# Altium schematic sheet [05] - PROGRAMMER.SchDoc
size A4
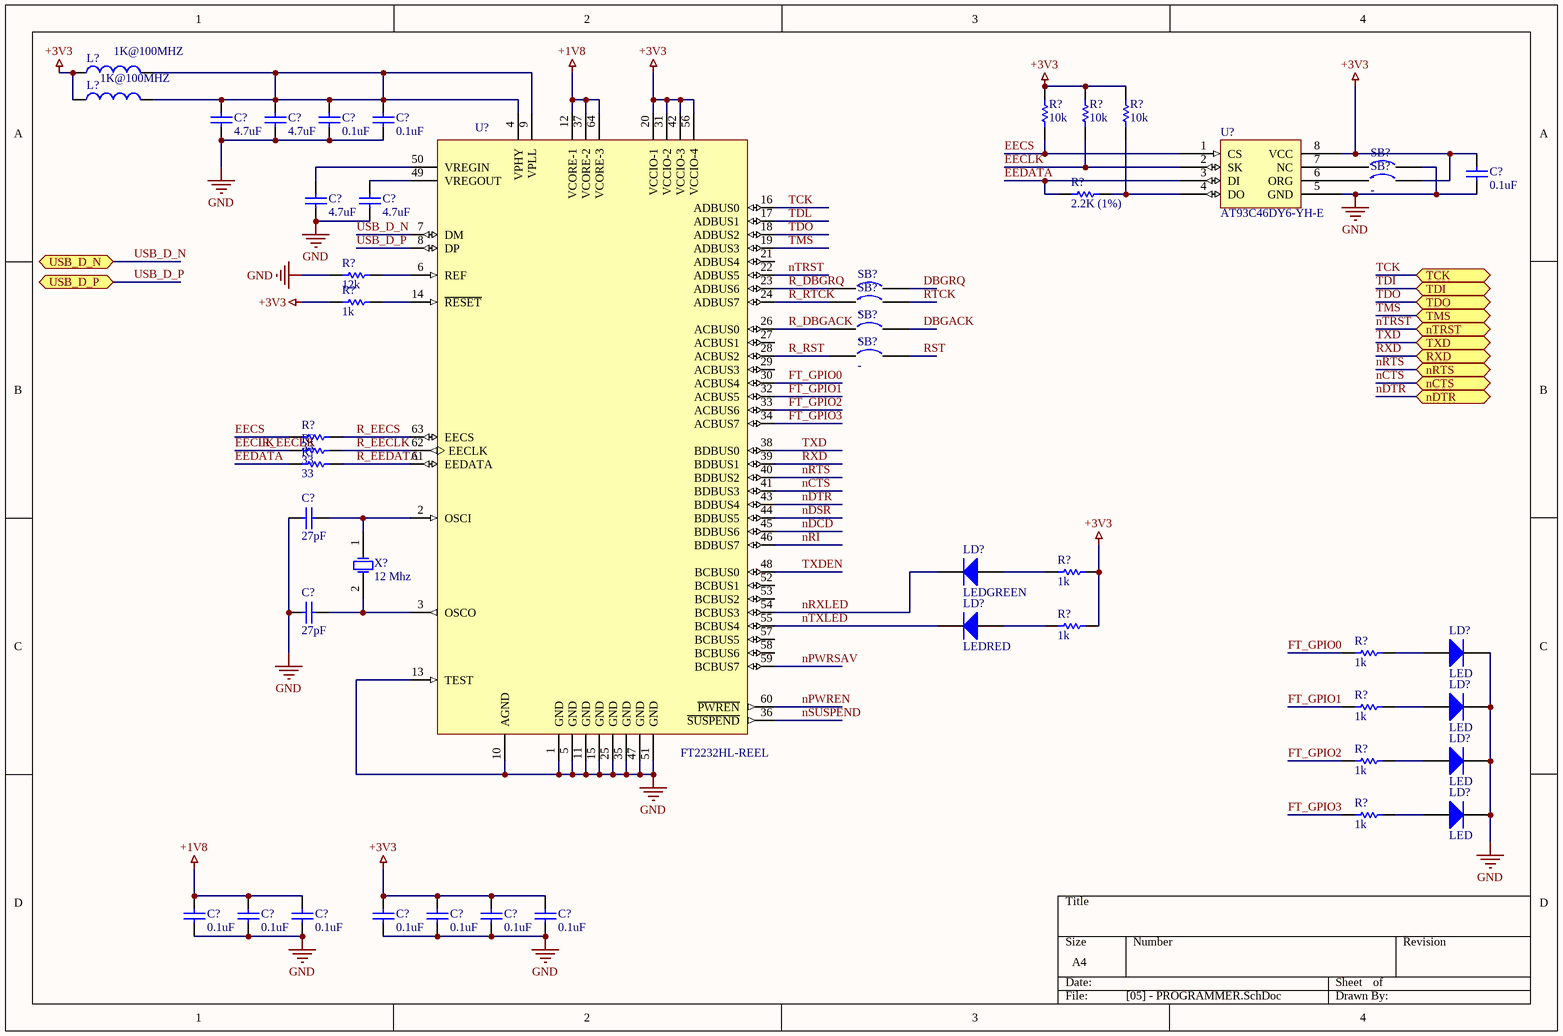
[diagram p0: [05] - PROGRAMMER.SchDoc]

## Parts
(Parts that share a designator on the sheet are numbered #1, #2 ... from top to bottom, then left to right.)
C?#1  0.1uF
C?#2  0.1uF
C?#3  4.7uF
C?#4  4.7uF
C?#5  0.1uF
C?#6  4.7uF
C?#7  4.7uF
C?#8  27pF
C?#9  27pF
C?#10  0.1uF
C?#11  0.1uF
C?#12  0.1uF
C?#13  0.1uF
C?#14  0.1uF
C?#15  0.1uF
C?#16  0.1uF
L?#1  1K@100MHZ
L?#2  1K@100MHZ
LD?#1  LEDGREEN
LD?#2  LEDRED
LD?#3  LED
LD?#4  LED
LD?#5  LED
LD?#6  LED
R?#1  10k
R?#2  10k
R?#3  10k
R?#4  2.2K (1%)
R?#5  12k
R?#6  1k
R?#7  33
R?#8  33
R?#9  33
R?#10  1k
R?#11  1k
R?#12  1k
R?#13  1k
R?#14  1k
R?#15  1k
SB?#1  -  [Solder Bridge]
SB?#2  -  [Solder Bridge]
SB?#3  -  [Solder Bridge]
SB?#4  -  [Solder Bridge]
SB?#5  -  [Solder Bridge]
SB?#6  -  [Solder Bridge]
U?#1  AT93C46DY6-YH-E
U?#2  FT2232HL-REEL  [*QFP50P1200X1200X160-64N]
X?  12 Mhz  [ABLS2-12.000MHZ-D4Y-T]

## Ports
nCTS (bidir), nDTR (bidir), nRTS (bidir), nTRST (bidir), RXD (bidir), TCK (bidir), TDI (bidir), TDO (bidir), TMS (bidir), TXD (bidir), USB_D_N (bidir), USB_D_P (bidir)

## Nets
+1V8: C?#10.2 C?#11.2 C?#12.2 U?#2.12(VCORE-1) U?#2.37(VCORE-2) U?#2.64(VCORE-3)
+3V3: C?#5.2 C?#13.2 C?#14.2 C?#15.2 C?#16.2 L?#1.1 L?#2.1 R?#1.2 R?#2.2 R?#3.2 R?#6.1 R?#10.2 R?#11.2 SB?#2.2 U?#1.8(VCC) U?#2.20(VCCIO-1) U?#2.31(VCCIO-2) U?#2.42(VCCIO-3) U?#2.56(VCCIO-4)
GND: C?#1.1 C?#2.1 C?#3.1 C?#4.1 C?#5.1 C?#6.2 C?#7.1 C?#8.2 C?#9.2 C?#10.1 C?#11.1 C?#12.1 C?#13.1 C?#14.1 C?#15.1 C?#16.1 LD?#3.2(K) LD?#4.2(K) LD?#5.2(K) LD?#6.2(K) R?#5.1 SB?#1.2 U?#1.5(GND) U?#2.1(GND) U?#2.5(GND) U?#2.10(AGND) U?#2.11(GND) U?#2.13(TEST) U?#2.15(GND) U?#2.25(GND) U?#2.35(GND) U?#2.47(GND) U?#2.51(GND)
DBGACK: SB?#5.2
DBGRQ: SB?#3.2
EECLK: R?#2.1 R?#8.1 R?#8.2 U?#1.2(SK) U?#2.62(EECLK)  [also labelled R_EECLK]
EECS: R?#1.1 R?#7.1 U?#1.1(CS)
EEDATA: R?#4.1 R?#9.1 U?#1.3(DI)
FT_GPIO0: R?#12.1 U?#2.30(ACBUS4)
FT_GPIO1: R?#13.1 U?#2.32(ACBUS5)
FT_GPIO2: R?#14.1 U?#2.33(ACBUS6)
FT_GPIO3: R?#15.1 U?#2.34(ACBUS7)
nCTS: U?#2.41(BDBUS3) ; port nCTS
nDCD: U?#2.45(BDBUS6)
nDSR: U?#2.44(BDBUS5)
nDTR: U?#2.43(BDBUS4) ; port nDTR
nPWREN: U?#2.60(~{PWREN})
nPWRSAV: U?#2.59(BCBUS7)
nRI: U?#2.46(BDBUS7)
nRTS: U?#2.40(BDBUS2) ; port nRTS
nRXLED: LD?#1.2(K) U?#2.54(BCBUS3)
nSUSPEND: U?#2.36(~{SUSPEND})
nTRST: U?#2.22(ADBUS5) ; port nTRST
nTXLED: LD?#2.2(K) U?#2.55(BCBUS4)
R_DBGACK: SB?#5.1 U?#2.26(ACBUS0)
R_DBGRQ: SB?#3.1 U?#2.23(ADBUS6)
R_EECS: R?#7.2 U?#2.63(EECS)
R_EEDATA: R?#9.2 U?#2.61(EEDATA)
R_RST: SB?#6.1 U?#2.28(ACBUS2)
R_RTCK: SB?#4.1 U?#2.24(ADBUS7)
RST: SB?#6.2
RTCK: SB?#4.2
RXD: U?#2.39(BDBUS1) ; port RXD
TCK: U?#2.16(ADBUS0) ; port TCK
TDI: port TDI
TDL: U?#2.17(ADBUS1)
TDO: U?#2.18(ADBUS2) ; port TDO
TMS: U?#2.19(ADBUS3) ; port TMS
TXD: U?#2.38(BDBUS0) ; port TXD
TXDEN: U?#2.48(BCBUS0)
USB_D_N: U?#2.7(DM) ; port USB_D_N
USB_D_P: U?#2.8(DP) ; port USB_D_P
NetC?#1_2: C?#1.2 C?#2.2 C?#3.2 C?#4.2 L?#1.2 L?#2.2 U?#2.4(VPHY) U?#2.9(VPLL)
NetC?#6_1: C?#6.1 U?#2.49(VREGOUT)
NetC?#7_2: C?#7.2 U?#2.50(VREGIN)
NetC?#8_1: C?#8.1 U?#2.2(OSCI) X?.1(OSC1)
NetC?#9_1: C?#9.1 U?#2.3(OSCO) X?.2(OSC2)
NetLD?#1_1: LD?#1.1(A) R?#10.1
NetLD?#2_1: LD?#2.1(A) R?#11.1
NetLD?#3_1: LD?#3.1(A) R?#12.2
NetLD?#4_1: LD?#4.1(A) R?#13.2
NetLD?#5_1: LD?#5.1(A) R?#14.2
NetLD?#6_1: LD?#6.1(A) R?#15.2
NetR?#3_1: R?#3.1 R?#4.2 U?#1.4(DO)
NetR?#5_2: R?#5.2 U?#2.6(REF)
NetR?#6_2: R?#6.2 U?#2.14(~{RESET})
NetSB?#1_1: SB?#1.1 U?#1.7(NC)
NetSB?#2_1: SB?#2.1 U?#1.6(ORG)

Not connected (* = marked no-connect by the designer): U?#2 21(ADBUS4) 27(ACBUS1) 29(ACBUS3) 52(BCBUS1) 53(BCBUS2) 57(BCBUS5) 58(BCBUS6)

## Library data of the parts
C?#1 C?#2 C?#5 C?#10-C?#16 = CL21B104KACNNNC: Cap Ceramic 0.1uF 25V X7R 10% SMD 0805 125C Paper T/R; Manufacturer: Samsung; Capacitance: 100nF; Supplier 1: Digi-Key; Manufacturer Part Number: CL21B104KACNNNC; Stock 1: 319136; RoHS: Yes; Mount: Surface Mount; Case/Package: 0805; Contact Plating: Tin; Case Code (Metric): 2012; Case Code (Imperial): 0805; Min Operating Temperature: -55°C; Max Operating Temperature: 125°C; Package Quantity: 1; Packaging: Tape and Reel; Voltage Rating: 25V; Tolerance: 10%; Dielectric: X7R; Voltage: 25V; Length: 2mm; Height: 0.85mm; Width: 0.049inch; Thickness: 0.037inch; Depth: 1.25mm; Radiation Hardening: No; ComponentLink1URL: https://datasheet.ciiva.com/25801/cl21b104kacnnnc-25801824.pdf?src-supplier=Digi-Key; ComponentLink1Description: https://datasheet.ciiva.com/25801/cl21b104kacnnnc-25801824.pdf?src-supplier=Digi-Key; ComponentLink2URL: https://datasheet.ciiva.com/15216/getdatasheetpartid-355204-15216236.pdf?src-supplier=Verical; ComponentLink2Description: https://datasheet.ciiva.com/15216/getdatasheetpartid-355204-15216236.pdf?src-supplier=Verical; Supplier Part Number 1: 1276-1099-1-ND
C?#3 C?#4 C?#6 C?#7 = CL21A475KOFNNNE: Cap Ceramic 4.7uF 16V X5R 10% SMD 0805 85C Embossed T/R; Manufacturer: Samsung; Supplier 1: Digi-Key; Manufacturer Part Number: CL21A475KOFNNNE; RoHS: Yes; Stock 1: 1779241; Pricing 1: 1 = 0,17000, 10 = 0,11600, 100 = 0,05860, 500 = 0,04010, 1000 = 0,03547 (USD); Mount: Surface Mount; Case/Package: 0805; Case Code (Metric): 2012; Case Code (Imperial): 0805; Contact Plating: Tin; Min Operating Temperature: -55°C; Max Operating Temperature: 85°C; Tolerance: 10%; Capacitance: 4.7uF; Dielectric: X5R; Packaging: Tape and Reel; Voltage Rating: 16V; Length: 2mm; Height: 1.25mm; Width: 0.049inch; Thickness: 0.053inch; Depth: 1.25mm; Radiation Hardening: No; ComponentLink1URL: https://datasheet.ciiva.com/26838/getdatasheetpartid-357424-26838625.pdf?src-supplier=Verical; ComponentLink1Description: https://datasheet.ciiva.com/26838/getdatasheetpartid-357424-26838625.pdf?src-supplier=Verical; ComponentLink2URL: https://datasheet.ciiva.com/25710/cl21a475kofnnne-25710354.pdf?src-supplier=Digi-Key; ComponentLink2Description: https://datasheet.ciiva.com/25710/cl21a475kofnnne-25710354.pdf?src-supplier=Digi-Key; ComponentLink3URL: https://datasheet.ciiva.com/16740/cl21a475kofnnne-16740646.pdf?src-supplier=Future+Electronics; ComponentLink3Description: https://datasheet.ciiva.com/16740/cl21a475kofnnne-16740646.pdf?src-supplier=Future+Electronics; Supplier Part Number 1: 1276-1065-1-ND
C?#8 C?#9 = C0805C270J5GACTU: Cap Ceramic 27pF 50V C0G 5% Pad SMD 0805 125C T/R; Manufacturer: KEMET; Temperature Coefficient: 30ppm/°C; Dissipation Factor: 0.1%; Supplier 1: Digi-Key; Manufacturer Part Number: C0805C270J5GACTU; RoHS: Yes; Stock 1: 57011; Pricing 1: 1 = 0,13000, 10 = 0,09600, 100 = 0,04260, 500 = 0,03046, 1000 = 0,02393 (USD); Mount: Surface Mount; Case/Package: 0805; Dielectric Material: Ceramic; Case Code (Metric): 2012; Case Code (Imperial): 0805; Contact Material: Tin; Contact Plating: Tin; Min Operating Temperature: -55°C; Max Operating Temperature: 125°C; Packaging: Tape and Reel; Capacitance: 27pF; Tolerance: 5%; Voltage Rating (DC): 50V; Dielectric: C0G; Termination: SMD/SMT; Voltage: 50V; Package Quantity: 1; Voltage Rating: 50V; Length: 2mm; Height: 0.78mm; Depth: 1.25mm; Width: 0.049inch; Thickness: 0.035inch; Lead Pitch: 0.75mm; Radiation Hardening: No; Lead Free: Lead Free; REACH SVHC: No SVHC; ComponentLink1URL: https://datasheet.ciiva.com/6136/1776096-6136764.pdf?src-supplier=Farnell; ComponentLink1Description: https://datasheet.ciiva.com/6136/1776096-6136764.pdf?src-supplier=Farnell; ComponentLink2URL: https://datasheet.ciiva.com/5411/kem-c1003-c0g-smd-356956-5411093.pdf?src-supplier=Mouser; ComponentLink2Description: https://datasheet.ciiva.com/5411/kem-c1003-c0g-smd-356956-5411093.pdf?src-supplier=Mouser; ComponentLink3URL: https://datasheet.ciiva.com/11463/kem-c1003-c0g-smd-11463574.pdf?src-supplier=Avnet; ComponentLink3Description: https://datasheet.ciiva.com/11463/kem-c1003-c0g-smd-11463574.pdf?src-supplier=Avnet; ComponentLink4URL: https://datasheet.ciiva.com/14589/70095383-14589446.pdf?src-supplier=Allied+Electronics; ComponentLink4Description: https://datasheet.ciiva.com/14589/70095383-14589446.pdf?src-supplier=Allied+Electronics; ComponentLink5URL: https://datasheet.ciiva.com/7842/f9080b-0402-series-c0g-7842586.pdf?src-supplier=Element14; ComponentLink5Description: https://datasheet.ciiva.com/7842/f9080b-0402-series-c0g-7842586.pdf?src-supplier=Element14; ComponentLink6URL: https://datasheet.ciiva.com/28696/1789732-28696026.pdf?src-supplier=Element14; ComponentLink6Description: https://datasheet.ciiva.com/28696/1789732-28696026.pdf?src-supplier=Element14; ComponentLink7URL: https://datasheet.ciiva.com/14608/70095383-14608091.pdf?src-supplier=Allied+Electronics; ComponentLink7Description: https://datasheet.ciiva.com/14608/70095383-14608091.pdf?src-supplier=Allied+Electronics; ComponentLink8URL: https://datasheet.ciiva.com/7842/1776096-7842300.pdf?src-supplier=Element14; ComponentLink8Description: https://datasheet.ciiva.com/7842/1776096-7842300.pdf?src-supplier=Element14; ComponentLink9URL: https://datasheet.ciiva.com/7842/1776096-7842301.pdf?src-supplier=Element14; ComponentLink9Description: https://datasheet.ciiva.com/7842/1776096-7842301.pdf?src-supplier=Element14; Supplier Part Number 1: 399-1114-1-ND
L?#1 L?#2 = BLM21AG102SN1D: MURATA - BLM21AG102SN1D - FERRITE BEAD, 1 KOHM, 500 mA, 0805; Material: Steel; Impedance: 1kR; Tolerance: 25%; Max DC Current: 200mA; DC Resistance (DCR): 280mR; Max Current Rating: 600mA; Current Rating: 500mA; Test Frequency: 100MHz; Number of Lines: 1; Shielding: Unshielded; Supplier 1: Digi-Key; Manufacturer: Murata; Manufacturer Part Number: BLM21AG102SN1D; RoHS: Yes; Stock 1: 2326407; Pricing 1: 1 = 0,17000, 10 = 0,14100, 25 = 0,10960, 50 = 0,09100, 100 = 0,07840, 250 = 0,06272, 500 = 0,05644, 1000 = 0,04703 (USD); Case/Package: 0805; Number of Pins: 2; Weight: 0.000194oz; Core Material: Ferrite; Case Code (Metric): 2012; Case Code (Imperial): 0805; Min Operating Temperature: -55°C; Max Operating Temperature: 125°C; Package Quantity: 1; Packaging: Tape and Reel; Termination: SMD/SMT; DC Current: 200mA; Military Standard: Not; Frequency: 100MHz; Number of Circuits: 1; Length: 2mm; Height: 0.85mm; Depth: 1.25mm; Width: 1.25mm; Radiation Hardening: No; REACH SVHC: No SVHC; Lead Free: Lead Free; ComponentLink1URL: https://datasheet.ciiva.com/19454/1845136-19454717.pdf?src-supplier=Jameco; ComponentLink1Description: https://datasheet.ciiva.com/19454/1845136-19454717.pdf?src-supplier=Jameco; ComponentLink2URL: https://datasheet.ciiva.com/18093/getdatasheetpartid-139643-18093010.pdf?src-supplier=Verical; ComponentLink2Description: https://datasheet.ciiva.com/18093/getdatasheetpartid-139643-18093010.pdf?src-supplier=Verical; ComponentLink3URL: https://datasheet.ciiva.com/41449/001172322-da-01-en-drossel-0805-1000r-2-0x1-25mm-4000st-41449636.pdf?src-supplier=Conrad; ComponentLink3Description: https://datasheet.ciiva.com/41449/001172322-da-01-en-drossel-0805-1000r-2-0x1-25mm-4000st-41449636.pdf?src-supplier=Conrad; ComponentLink4URL: https://datasheet.ciiva.com/29347/442432-da-01-en-chip-drossel-0805-1000r-200ma-2-0x1-25mm-29347996.pdf?src-supplier=Conrad; ComponentLink4Description: https://datasheet.ciiva.com/29347/442432-da-01-en-chip-drossel-0805-1000r-200ma-2-0x1-25mm-29347996.pdf?src-supplier=Conrad; ComponentLink5URL: https://datasheet.ciiva.com/25903/l0110s0100blm21a-25903493.pdf?src-supplier=Avnet+Europe; ComponentLink5Description: https://datasheet.ciiva.com/25903/l0110s0100blm21a-25903493.pdf?src-supplier=Avnet+Europe; ComponentLink6URL: https://datasheet.ciiva.com/3081/l0110s0100blm21a-3081640.pdf?src-supplier=Avnet; ComponentLink6Description: https://datasheet.ciiva.com/3081/l0110s0100blm21a-3081640.pdf?src-supplier=Avnet; ComponentLink7URL: https://datasheet.ciiva.com/3082/l0110s0100blm21a-3082728.pdf?src-supplier=Avnet; ComponentLink7Description: https://datasheet.ciiva.com/3082/l0110s0100blm21a-3082728.pdf?src-supplier=Avnet; ComponentLink8URL: https://datasheet.ciiva.com/6212/l0110s0100blm21a-6212345.pdf?src-supplier=Digi-Key; ComponentLink8Description: https://datasheet.ciiva.com/6212/l0110s0100blm21a-6212345.pdf?src-supplier=Digi-Key; ComponentLink9URL: https://datasheet.ciiva.com/6212/l0110s0100blm21a-6212347.pdf?src-supplier=Digi-Key; ComponentLink9Description: https://datasheet.ciiva.com/6212/l0110s0100blm21a-6212347.pdf?src-supplier=Digi-Key; ComponentLink10URL: https://datasheet.ciiva.com/8021/l0110s0100blm21a-8021548.pdf?src-supplier=Element14; ComponentLink10Description: https://datasheet.ciiva.com/8021/l0110s0100blm21a-8021548.pdf?src-supplier=Element14; ComponentLink11URL: https://datasheet.ciiva.com/16286/l0110s0100blm21a-16286461.pdf?src-supplier=Future+Electronics; ComponentLink11Description: https://datasheet.ciiva.com/16286/l0110s0100blm21a-16286461.pdf?src-supplier=Future+Electronics; ComponentLink12URL: https://datasheet.ciiva.com/6212/l0110s0100blm21a-6212318.pdf?src-supplier=Digi-Key; ComponentLink12Description: https://datasheet.ciiva.com/6212/l0110s0100blm21a-6212318.pdf?src-supplier=Digi-Key; ComponentLink13URL: https://datasheet.ciiva.com/8021/l0110s0100blm21a-8021550.pdf?src-supplier=Element14; ComponentLink13Description: https://datasheet.ciiva.com/8021/l0110s0100blm21a-8021550.pdf?src-supplier=Element14; Supplier Part Number 1: 490-1041-1-ND
LD?#1 = LTST-C191KGKT: LED GREEN CLEAR SMD; Manufacturer: Vishay Lite-On; Lens Color: Colorless; Luminous Intensity: 35mcd; Viewing Angle: 130°; Forward Voltage: 2V; Dominant Wavelength: 571nm; Test Current: 20mA; Wavelength: 574nm; Lens Style: Diffused; Forward Current: 30mA; Number of Elements: 1; Power Dissipation: 75mW; Reverse Voltage: 5V; Supplier 1: Digi-Key; Manufacturer Part Number: LTST-C191KGKT; RoHS: Yes; Stock 1: 1365000; Pricing 1: 5000 = 0,040400, 10000 = 0,036360, 25000 = 0,032320, 50000 = 0,029290, 125000 = 0,027270 (USD); Mount: Surface Mount; Case/Package: 0603; Number of Pins: 2; Color: Green; Case Code (Metric): 1608; Case Code (Imperial): 0603; Min Operating Temperature: -55°C; Max Operating Temperature: 85°C; Packaging: Tape and Reel; Package Quantity: 1; Lens Transparency: Clear; Illumination Color: Green; Number of LEDs: 1; Power Rating: 75mW; Length: 1.6mm; Height: 0.55mm; Width: 0.8mm; Depth: 0.8mm; Radiation Hardening: No; Lead Free: Lead Free; ComponentLink1URL: https://datasheet.ciiva.com/11773/0900766b80dc02b1-11773629.pdf?src-supplier=RSComponents; ComponentLink1Description: https://datasheet.ciiva.com/11773/0900766b80dc02b1-11773629.pdf?src-supplier=RSComponents; ComponentLink2URL: https://datasheet.ciiva.com/12400/100-ltst-c191kgkt-53586-12400818.pdf?src-supplier=Mouser; ComponentLink2Description: https://datasheet.ciiva.com/12400/100-ltst-c191kgkt-53586-12400818.pdf?src-supplier=Mouser; ComponentLink3URL: https://datasheet.ciiva.com/16215/ltst-c191kgkt-16215151.pdf?src-supplier=Future+Electronics; ComponentLink3Description: https://datasheet.ciiva.com/16215/ltst-c191kgkt-16215151.pdf?src-supplier=Future+Electronics; ComponentLink4URL: https://datasheet.ciiva.com/2109/s-110-ltst-c191kgkt-2109973.pdf?src-supplier=Digi-Key; ComponentLink4Description: https://datasheet.ciiva.com/2109/s-110-ltst-c191kgkt-2109973.pdf?src-supplier=Digi-Key; ComponentLink5URL: https://datasheet.ciiva.com/2109/s-110-ltst-c191kgkt-2109974.pdf?src-supplier=Digi-Key; ComponentLink5Description: https://datasheet.ciiva.com/2109/s-110-ltst-c191kgkt-2109974.pdf?src-supplier=Digi-Key; ComponentLink6URL: https://datasheet.ciiva.com/2109/s-110-ltst-c191kgkt-2109975.pdf?src-supplier=Digi-Key; ComponentLink6Description: https://datasheet.ciiva.com/2109/s-110-ltst-c191kgkt-2109975.pdf?src-supplier=Digi-Key; ComponentLink7URL: https://datasheet.ciiva.com/15223/getdatasheetpartid-103913-15223276.pdf?src-supplier=Verical; ComponentLink7Description: https://datasheet.ciiva.com/15223/getdatasheetpartid-103913-15223276.pdf?src-supplier=Verical; Supplier Part Number 1: 160-1446-2-ND
LD?#2 = LTST-C191KRKT: LED RED CLEAR SMD; Manufacturer: Vishay Lite-On; Lens Color: Colorless; Luminous Intensity: 54mcd; Viewing Angle: 130°; Forward Voltage: 2V; Dominant Wavelength: 631nm; Test Current: 20mA; Wavelength: 639nm; Forward Current: 30mA; Number of Elements: 1; Power Dissipation: 75mW; Reverse Voltage: 5V; Current: 2A; Supplier 1: Digi-Key; Manufacturer Part Number: LTST-C191KRKT; RoHS: Yes; Stock 1: 1090000; Pricing 1: 5000 = 0,04040, 10000 = 0,03636, 25000 = 0,03232, 50000 = 0,02929, 125000 = 0,02727 (USD); Mount: Surface Mount; Case/Package: 0603; Number of Pins: 2; Color: Red; Case Code (Metric): 1608; Case Code (Imperial): 0603; Min Operating Temperature: -55°C; Max Operating Temperature: 85°C; Packaging: Tape and Reel; Package Quantity: 1; Lens Transparency: Clear; Lens Style: Clear; Illumination Color: Red; Number of LEDs: 1; Power Rating: 75mW; Voltage: 2V; Length: 1.6mm; Height: 0.55mm; Width: 0.8mm; Depth: 0.8mm; Radiation Hardening: No; Lead Free: Lead Free; ComponentLink1URL: https://datasheet.ciiva.com/15117/getdatasheetpartid-141922-15117737.pdf?src-supplier=Verical; ComponentLink1Description: https://datasheet.ciiva.com/15117/getdatasheetpartid-141922-15117737.pdf?src-supplier=Verical; ComponentLink2URL: https://datasheet.ciiva.com/12400/lite-on-ltst-c191krkt-190135-12400910.pdf?src-supplier=Mouser; ComponentLink2Description: https://datasheet.ciiva.com/12400/lite-on-ltst-c191krkt-190135-12400910.pdf?src-supplier=Mouser; ComponentLink3URL: https://datasheet.ciiva.com/11773/0900766b80dc02b2-11773601.pdf?src-supplier=RSComponents; ComponentLink3Description: https://datasheet.ciiva.com/11773/0900766b80dc02b2-11773601.pdf?src-supplier=RSComponents; ComponentLink4URL: https://datasheet.ciiva.com/16212/ltst-c191krkt-16212419.pdf?src-supplier=Future+Electronics; ComponentLink4Description: https://datasheet.ciiva.com/16212/ltst-c191krkt-16212419.pdf?src-supplier=Future+Electronics; ComponentLink5URL: https://datasheet.ciiva.com/2109/s-110-ltst-c191krkt-2109972.pdf?src-supplier=Digi-Key; ComponentLink5Description: https://datasheet.ciiva.com/2109/s-110-ltst-c191krkt-2109972.pdf?src-supplier=Digi-Key; ComponentLink6URL: https://datasheet.ciiva.com/2109/s-110-ltst-c191krkt-2109970.pdf?src-supplier=Digi-Key; ComponentLink6Description: https://datasheet.ciiva.com/2109/s-110-ltst-c191krkt-2109970.pdf?src-supplier=Digi-Key; ComponentLink7URL: https://datasheet.ciiva.com/2109/s-110-ltst-c191krkt-2109971.pdf?src-supplier=Digi-Key; ComponentLink7Description: https://datasheet.ciiva.com/2109/s-110-ltst-c191krkt-2109971.pdf?src-supplier=Digi-Key; Supplier Part Number 1: 160-1447-2-ND
LD?#3-LD?#6 = LTST-C191KFKT: LED ORANGE CLEAR SMD; Manufacturer: Vishay Lite-On; Lens Color: Colorless; Viewing Angle: 130°; Lens Style: Diffused; Luminous Intensity: 90mcd; Forward Current: 30mA; Forward Voltage: 2V; Test Current: 20mA; Number of Elements: 1; Power Dissipation: 75mW; Reverse Voltage: 5V; Dominant Wavelength: 605nm; Wavelength: 611nm; Supplier 1: Digi-Key; Manufacturer Part Number: LTST-C191KFKT; RoHS: Yes; Stock 1: 129346; Pricing 1: 1 = 0,27000, 10 = 0,19600, 25 = 0,14480, 100 = 0,10340, 250 = 0,07032, 500 = 0,06204, 1000 = 0,04860, 2500 = 0,04756 (USD); Mount: Surface Mount; Case/Package: 0603; Number of Pins: 2; Color: Orange; Case Code (Metric): 1608; Case Code (Imperial): 0603; Min Operating Temperature: -55°C; Max Operating Temperature: 85°C; Package Quantity: 1; Packaging: Tape and Reel; Illumination Color: Orange; Lens Transparency: Clear; Number of LEDs: 1; Power Rating: 75mW; Length: 1.6mm; Height: 0.55mm; Depth: 0.8mm; Width: 0.8mm; Radiation Hardening: No; Lead Free: Lead Free; ComponentLink1URL: https://datasheet.ciiva.com/2109/ltst-c191kfkt-2109968.pdf?src-supplier=Digi-Key; ComponentLink1Description: https://datasheet.ciiva.com/2109/ltst-c191kfkt-2109968.pdf?src-supplier=Digi-Key; ComponentLink2URL: https://datasheet.ciiva.com/12400/100-ltst-c191kfkt-39904-12400811.pdf?src-supplier=Mouser; ComponentLink2Description: https://datasheet.ciiva.com/12400/100-ltst-c191kfkt-39904-12400811.pdf?src-supplier=Mouser; ComponentLink3URL: https://datasheet.ciiva.com/11775/0900766b80dc02b0-11775613.pdf?src-supplier=RSComponents; ComponentLink3Description: https://datasheet.ciiva.com/11775/0900766b80dc02b0-11775613.pdf?src-supplier=RSComponents; ComponentLink4URL: https://datasheet.ciiva.com/15201/getdatasheetpartid-631075-15201391.pdf?src-supplier=Verical; ComponentLink4Description: https://datasheet.ciiva.com/15201/getdatasheetpartid-631075-15201391.pdf?src-supplier=Verical; ComponentLink5URL: https://datasheet.ciiva.com/2109/s-110-ltst-c191kfkt-2109969.pdf?src-supplier=Digi-Key; ComponentLink5Description: https://datasheet.ciiva.com/2109/s-110-ltst-c191kfkt-2109969.pdf?src-supplier=Digi-Key; Supplier Part Number 1: 160-1445-1-ND
R?#1-R?#3 = RC2012F103CS: Res Thick Film 0805 10K Ohm 1% 0.125W(1/8W) ±100ppm/C Molded SMD T/R; Manufacturer: Samsung; Resistance: 10kR; Power Rating: 125mW; Temperature Coefficient: 100ppm/°C; Supplier 1: Digi-Key; Manufacturer Part Number: RC2012F103CS; Stock 1: 565008; RoHS: Yes; Case/Package: 0805; Case Code (Metric): 2012; Case Code (Imperial): 0805; Contact Plating: Tin; Min Operating Temperature: -55°C; Max Operating Temperature: 155°C; Tolerance: 1%; Packaging: Tape and Reel; Composition: Thick Film; Package Quantity: 1; Number of Terminations: 2; Military Standard: Not; Max Power Dissipation: 125mW; Features: Moisture Resistant; Length: 0.079inch; Height: 0.024inch; Width: 0.049inch; Depth: 1.25mm; Radiation Hardening: No; ComponentLink1URL: http://components.arrow.com/part/dataview/0323_04212069?src-supplier=Arrow+Europe; ComponentLink1Description: http://components.arrow.com/part/dataview/0323_04212069?src-supplier=Arrow+Europe; ComponentLink2URL: http://www1.futureelectronics.com/doc/SAMSUNG/RCSERIES.pdf?src-supplier=Future+Electronics; ComponentLink2Description: http://www1.futureelectronics.com/doc/SAMSUNG/RCSERIES.pdf?src-supplier=Future+Electronics; ComponentLink3URL: https://sem.samsung.co.kr/servlet/DownloadServlet?dir=product/en/A070002&num=&fileName=Resistor-Precision1.pdf&src-supplier=Avnet; ComponentLink3Description: https://sem.samsung.co.kr/servlet/DownloadServlet?dir=product/en/A070002&num=&fileName=Resistor-Precision1.pdf&src-supplier=Avnet; ComponentLink4URL: http://www.samsungsem.com/kr/support/product-search/chip-resistor/RC2012F103CS.jsp?src-supplier=Digi-Key; ComponentLink4Description: http://www.samsungsem.com/kr/support/product-search/chip-resistor/RC2012F103CS.jsp?src-supplier=Digi-Key; ComponentLink5URL: https://sem.samsung.co.kr/servlet/DownloadServlet?dir=product/en/A070002&num=&fileName=Resistor-Precision1.pdf&src-supplier=Avnet+Europe; ComponentLink5Description: https://sem.samsung.co.kr/servlet/DownloadServlet?dir=product/en/A070002&num=&fileName=Resistor-Precision1.pdf&src-supplier=Avnet+Europe; ComponentLink6URL: http://components.arrow.com/part/dataview/51841145S9370186N4139?src-supplier=Arrow; ComponentLink6Description: http://components.arrow.com/part/dataview/51841145S9370186N4139?src-supplier=Arrow; Supplier Part Number 1: 1276-5332-1-ND
R?#4 = RC2012J222CS: Res Thick Film 0805 2.2K Ohm 5% 0.125W(1/8W) ±100ppm/C Molded SMD T/R; Manufacturer: Samsung; Resistance: 2.2kR; Max Power Dissipation: 125mW; Temperature Coefficient: 100ppm/°C; Voltage Rating (DC): 150V; Supplier 1: Digi-Key; Manufacturer Part Number: RC2012J222CS; RoHS: Yes; Stock 1: 78131; Pricing 1: 1 = 0,10000, 10 = 0,04900, 100 = 0,02000, 1000 = 0,00899, 2500 = 0,00780 (USD); Case/Package: 0805; Case Code (Metric): 2012; Case Code (Imperial): 0805; Contact Plating: Tin; Min Operating Temperature: -55°C; Max Operating Temperature: 155°C; Tolerance: 5%; Packaging: Tape and Reel; Composition: Thick Film; Number of Terminations: 2; Military Standard: Not; Features: Moisture Resistant; Length: 2mm; Height: 0.024inch; Width: 0.049inch; Depth: 1.25mm; Radiation Hardening: No; Lead Free: Lead Free; ComponentLink1URL: https://datasheet.ciiva.com/15196/getdatasheetpartid-714716-15196269.pdf?src-supplier=Verical; ComponentLink1Description: https://datasheet.ciiva.com/15196/getdatasheetpartid-714716-15196269.pdf?src-supplier=Verical; ComponentLink2URL: https://datasheet.ciiva.com/26157/chip-resistor-150112-1-26157477.pdf?src-supplier=Digi-Key; ComponentLink2Description: https://datasheet.ciiva.com/26157/chip-resistor-150112-1-26157477.pdf?src-supplier=Digi-Key; ComponentLink3URL: https://datasheet.ciiva.com/26157/chip-resistor-150112-1-26157487.pdf?src-supplier=Digi-Key; ComponentLink3Description: https://datasheet.ciiva.com/26157/chip-resistor-150112-1-26157487.pdf?src-supplier=Digi-Key; ComponentLink4URL: https://datasheet.ciiva.com/26157/chip-resistor-150112-1-26157503.pdf?src-supplier=Digi-Key; ComponentLink4Description: https://datasheet.ciiva.com/26157/chip-resistor-150112-1-26157503.pdf?src-supplier=Digi-Key; Supplier Part Number 1: 1276-5537-1-ND
R?#5 = RC2012F123CS: Res Thick Film 0805 12K Ohm 1% 0.125W(1/8W) ±100ppm/C Molded SMD T/R; Manufacturer: Samsung; Resistance: 12kR; Max Power Dissipation: 125mW; Temperature Coefficient: 100ppm/°C; Voltage Rating (DC): 150V; Supplier 1: Digi-Key; Manufacturer Part Number: RC2012F123CS; RoHS: Yes; Stock 1: 4; Pricing 1: 1 = 0,10000 (USD); Case/Package: 0805; Case Code (Metric): 2012; Case Code (Imperial): 0805; Contact Plating: Tin; Min Operating Temperature: -55°C; Max Operating Temperature: 155°C; Tolerance: 1%; Packaging: Tape and Reel; Composition: Thick Film; Package Quantity: 1; Number of Terminations: 2; Military Standard: Not; Features: Moisture Resistant; Length: 0.079inch; Height: 0.024inch; Width: 0.049inch; Depth: 1.25mm; Radiation Hardening: No; Lead Free: Lead Free; ComponentLink1URL: http://components.arrow.com/part/dataview/53385205S9998783N4139?src-supplier=Arrow; ComponentLink1Description: http://components.arrow.com/part/dataview/53385205S9998783N4139?src-supplier=Arrow; ComponentLink2URL: http://components.arrow.com/part/dataview/0323_06012576?src-supplier=Arrow+Europe; ComponentLink2Description: http://components.arrow.com/part/dataview/0323_06012576?src-supplier=Arrow+Europe; ComponentLink3URL: http://www.samsungsem.com/kr/support/library/product-catalog/__icsFiles/afieldfile/2015/09/22/CHIP_RESISTOR_2015.pdf?src-supplier=Digi-Key; ComponentLink3Description: http://www.samsungsem.com/kr/support/library/product-catalog/__icsFiles/afieldfile/2015/09/22/CHIP_RESISTOR_2015.pdf?src-supplier=Digi-Key; ComponentLink4URL: http://www.samsungsem.com/servlet/FileDownload?type=spec&file=RC2012F111CS.pdf&src-supplier=Avnet; ComponentLink4Description: http://www.samsungsem.com/servlet/FileDownload?type=spec&file=RC2012F111CS.pdf&src-supplier=Avnet; Supplier Part Number 1: 1276-5337-1-ND
R?#6 R?#10-R?#15 = RC2012F102CS: Res Thick Film 0805 1K Ohm 1% 1/8W ±100ppm/°C Molded SMD SMD T/R; Manufacturer: Samsung; Resistance: 1kR; Max Power Dissipation: 125mW; Voltage Rating (DC): 150V; Supplier 1: Digi-Key; Manufacturer Part Number: RC2012F102CS; Stock 1: 37707; Pricing 1: 1 = 0,10000, 10 = 0,05600, 100 = 0,02290, 1000 = 0,01030, 2500 = 0,00894 (USD); Case/Package: 0805; Case Code (Metric): 2012; Case Code (Imperial): 0805; Contact Plating: Tin; Min Operating Temperature: -55°C; Max Operating Temperature: 155°C; Tolerance: 1%; Packaging: Tape and Reel; Composition: Thick Film; Number of Terminations: 2; Military Standard: Not; Temperature Coefficient: 100ppm/°C; Features: Moisture Resistant; Length: 0.079inch; Height: 0.024inch; Width: 0.049inch; Depth: 1.25mm; Radiation Hardening: No; Lead Free: Lead Free; ComponentLink1URL: https://datasheet.ciiva.com/26151/chip-resistor-150112-1-26151882.pdf?src-supplier=Digi-Key; ComponentLink1Description: https://datasheet.ciiva.com/26151/chip-resistor-150112-1-26151882.pdf?src-supplier=Digi-Key; ComponentLink2URL: https://datasheet.ciiva.com/26151/chip-resistor-150112-1-26151870.pdf?src-supplier=Digi-Key; ComponentLink2Description: https://datasheet.ciiva.com/26151/chip-resistor-150112-1-26151870.pdf?src-supplier=Digi-Key; ComponentLink3URL: http://datasheet.octopart.com/RC2012F102CS-Samsung-datasheet-41960856.pdf; ComponentLink3Description: http://datasheet.octopart.com/RC2012F102CS-Samsung-datasheet-41960856.pdf; Supplier Part Number 1: 1276-5272-1-ND
R?#7-R?#9 = RC2012F330CS: RES SMD 33 OHM 1% 1/8W 0805; Manufacturer: Samsung; Resistance: 33R; Max Power Dissipation: 125mW; Temperature Coefficient: 100ppm/°C; Voltage Rating (DC): 150V; Supplier 1: Digi-Key; Manufacturer Part Number: RC2012F330CS; RoHS: Yes; Stock 1: 153502; Pricing 1: 1 = 0,10000, 10 = 0,05600, 100 = 0,02290, 1000 = 0,01030, 2500 = 0,00894 (USD); Case/Package: 0805; Case Code (Metric): 2012; Case Code (Imperial): 0805; Contact Plating: Tin; Min Operating Temperature: -55°C; Max Operating Temperature: 155°C; Tolerance: 1%; Packaging: Tape and Reel; Composition: Thick Film; Number of Terminations: 2; Military Standard: Not; Features: Moisture Resistant; Length: 0.079inch; Height: 0.024inch; Width: 0.049inch; Depth: 1.25mm; Radiation Hardening: No; Lead Free: Lead Free; ComponentLink1URL: https://datasheet.ciiva.com/26154/chip-resistor-150112-1-26154174.pdf?src-supplier=Digi-Key; ComponentLink1Description: https://datasheet.ciiva.com/26154/chip-resistor-150112-1-26154174.pdf?src-supplier=Digi-Key; ComponentLink2URL: https://datasheet.ciiva.com/26154/chip-resistor-150112-1-26154150.pdf?src-supplier=Digi-Key; ComponentLink2Description: https://datasheet.ciiva.com/26154/chip-resistor-150112-1-26154150.pdf?src-supplier=Digi-Key; ComponentLink3URL: https://datasheet.ciiva.com/26154/chip-resistor-150112-1-26154140.pdf?src-supplier=Digi-Key; ComponentLink3Description: https://datasheet.ciiva.com/26154/chip-resistor-150112-1-26154140.pdf?src-supplier=Digi-Key; Supplier Part Number 1: 1276-5201-1-ND
SB?#1-SB?#6 = Solder Bridge
U?#1 = AT93C46DY6-YH-E: EEPROM Serial-3Wire 1K-bit 128 x 8/64 x 16 2.5V/3.3V/5V Automotive 8-Pin UDFN EP T/R; Manufacturer: Microchip; Supplier 1: Digikey; Manufacturer Part Number: AT93C46DY6-YH-E; Stock 1: 27382; Pricing 1: 1 = 0,23000, 25 = 0,21640, 100 = 0,21190 (USD); Supplier Part Number 1: AT93C46DY6-YH-ECT-ND
U?#2 = FT2232HL-REEL: Dual High Speed USB UART/FIFO IC LQFP64; MF: FTDI; Data Rate: 480Mbps; Max Supply Voltage: 3.63V; Min Supply Voltage: 1.62V; Number of Channels: 2; Operating Supply Voltage: 3.3V; Operating Supply Current: 70mA; Number of Transceivers: 4; ESD Protection: Yes; Package: LQFP-64 FTDI; MP: FT2232HL; SnapEDA_Link: https://www.snapeda.com/parts/FT2232HL/FTDI/view-part/?ref=snap; Availability: Unavailable; Price: None; Value: *; Supplier 1: Digi-Key; Manufacturer: FTDI; Manufacturer Part Number: FT2232HL-REEL; RoHS: Yes; Stock 1: 34676; Pricing 1: 1 = 6,71000, 10 = 6,20000, 50 = 5,77000, 100 = 5,40000, 250 = 4,56000, 500 = 4,06002 (USD); Mount: Surface Mount; Case/Package: LQFP; Number of Pins: 64; Weight: 0.012088oz; Min Operating Temperature: -40°C; Max Operating Temperature: 85°C; Packaging: Tape and Reel; Package Quantity: 1000; Dual Supply Voltage: 3.3V; Features: I²C; Length: 10.1mm; Height: 1.4mm; Width: 10.1mm; Radiation Hardening: No; Lead Free: Lead Free; ComponentLink1URL: https://datasheet.ciiva.com/26841/ft2232hl-reel-26841742.pdf?src-supplier=IIIC; ComponentLink1Description: https://datasheet.ciiva.com/26841/ft2232hl-reel-26841742.pdf?src-supplier=IIIC; ComponentLink2URL: https://datasheet.ciiva.com/1787/ds-ft2232h-1787542.pdf?src-supplier=Digi-Key; ComponentLink2Description: https://datasheet.ciiva.com/1787/ds-ft2232h-1787542.pdf?src-supplier=Digi-Key; ComponentLink3URL: https://datasheet.ciiva.com/1787/ds-ft2232h-1787543.pdf?src-supplier=Digi-Key; ComponentLink3Description: https://datasheet.ciiva.com/1787/ds-ft2232h-1787543.pdf?src-supplier=Digi-Key; ComponentLink4URL: https://datasheet.ciiva.com/1787/ds-ft2232h-1787544.pdf?src-supplier=Digi-Key; ComponentLink4Description: https://datasheet.ciiva.com/1787/ds-ft2232h-1787544.pdf?src-supplier=Digi-Key; ComponentLink5URL: https://datasheet.ciiva.com/15224/getdatasheetpartid-644710-15224922.pdf?src-supplier=Verical; ComponentLink5Description: https://datasheet.ciiva.com/15224/getdatasheetpartid-644710-15224922.pdf?src-supplier=Verical; ComponentLink6URL: https://datasheet.ciiva.com/4787/ds-ft2232h-17353-4787707.pdf?src-supplier=Mouser; ComponentLink6Description: https://datasheet.ciiva.com/4787/ds-ft2232h-17353-4787707.pdf?src-supplier=Mouser; Supplier Part Number 1: 768-1024-1-ND
X? = ABLS2-12.000MHZ-D4Y-T: CRYSTAL 12.0000MHZ 18PF SMD; Manufacturer: Abracon; ESR (Equivalent Series Resistance): 50R; Frequency: 12MHz; Tolerance: 30ppm; Supplier 1: Digi-Key; Manufacturer Part Number: ABLS2-12.000MHZ-D4Y-T; RoHS: Yes; Stock 1: 32280; Pricing 1: 1 = 0,33000, 10 = 0,27500, 50 = 0,24760, 100 = 0,22000, 500 = 0,20900 (USD); Mount: Surface Mount; Number of Pins: 2; Min Operating Temperature: -40°C; Max Operating Temperature: 85°C; Load Capacitance: 18pF; Package Quantity: 1000; Packaging: Tape and Reel; Frequency Tolerance: 30ppm; Frequency Stability: 30ppm; Termination: SMD/SMT; Series Resistance: 50R; Length: 11.4mm; Height: 0.13inch; Width: 4.7mm; Depth: 4.7mm; REACH SVHC: Unknown; Lead Free: Lead Free; ComponentLink1URL: https://datasheet.ciiva.com/15116/getdatasheetpartid-719896-15116779.pdf?src-supplier=Verical; ComponentLink1Description: https://datasheet.ciiva.com/15116/getdatasheetpartid-719896-15116779.pdf?src-supplier=Verical; ComponentLink2URL: https://datasheet.ciiva.com/16208/abls2-16208630.pdf?src-supplier=Future+Electronics; ComponentLink2Description: https://datasheet.ciiva.com/16208/abls2-16208630.pdf?src-supplier=Future+Electronics; ComponentLink3URL: https://datasheet.ciiva.com/854/abls2-854393.pdf?src-supplier=Digi-Key; ComponentLink3Description: https://datasheet.ciiva.com/854/abls2-854393.pdf?src-supplier=Digi-Key; ComponentLink4URL: https://datasheet.ciiva.com/854/abls2-854394.pdf?src-supplier=Digi-Key; ComponentLink4Description: https://datasheet.ciiva.com/854/abls2-854394.pdf?src-supplier=Digi-Key; ComponentLink5URL: https://datasheet.ciiva.com/3175/abls2-3175498.pdf?src-supplier=Avnet; ComponentLink5Description: https://datasheet.ciiva.com/3175/abls2-3175498.pdf?src-supplier=Avnet; ComponentLink6URL: https://datasheet.ciiva.com/854/abls2-854395.pdf?src-supplier=Digi-Key; ComponentLink6Description: https://datasheet.ciiva.com/854/abls2-854395.pdf?src-supplier=Digi-Key; ComponentLink7URL: https://datasheet.ciiva.com/7998/abls2-7998445.pdf?src-supplier=Element14; ComponentLink7Description: https://datasheet.ciiva.com/7998/abls2-7998445.pdf?src-supplier=Element14; Supplier Part Number 1: 535-9869-1-ND